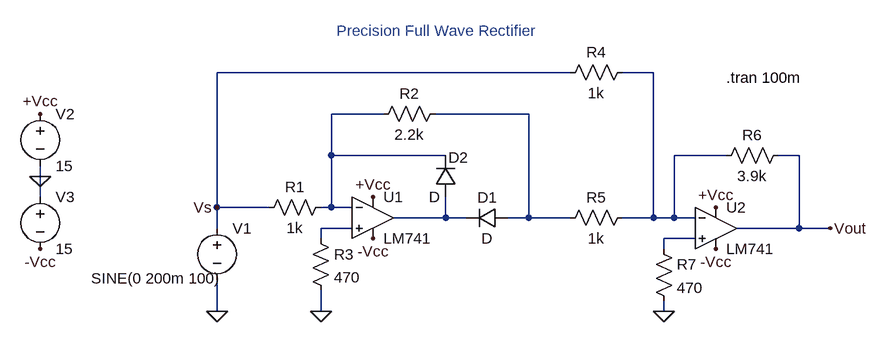
[diagram p0: schematic FWRect.asc]
FWRect.asc, the LTspice schematic file:
Version 4
SHEET 1 1192 680
WIRE 720 -96 176 -96
WIRE 848 -96 800 -96
WIRE 432 -32 352 -32
WIRE 656 -32 512 -32
WIRE 352 32 352 -32
WIRE 528 32 352 32
WIRE 960 32 880 32
WIRE 1072 32 1040 32
WIRE -96 64 -96 48
WIRE -96 96 -96 64
WIRE 176 112 176 -96
WIRE 256 112 176 112
WIRE 352 112 352 32
WIRE 352 112 336 112
WIRE 384 112 352 112
WIRE 528 128 528 96
WIRE 528 128 448 128
WIRE 560 128 528 128
WIRE 656 128 656 -32
WIRE 656 128 624 128
WIRE 720 128 656 128
WIRE 848 128 848 -96
WIRE 848 128 800 128
WIRE 880 128 880 32
WIRE 880 128 848 128
WIRE 912 128 880 128
WIRE 176 144 176 112
WIRE 384 144 336 144
WIRE 1072 144 1072 32
WIRE 1072 144 976 144
WIRE 1120 144 1072 144
WIRE 336 160 336 144
WIRE 912 160 864 160
WIRE 864 176 864 160
WIRE 176 272 176 224
WIRE 336 272 336 240
WIRE 864 272 864 256
FLAG 336 272 0
FLAG 176 272 0
FLAG -96 64 0
FLAG -96 -32 +Vcc
FLAG 416 96 +Vcc
FLAG -96 176 -Vcc
FLAG 416 160 -Vcc
FLAG 944 112 +Vcc
FLAG 944 176 -Vcc
FLAG 864 272 0
FLAG 176 112 Vs
FLAG 1120 144 Vout
SYMBOL voltage 176 128 R0
WINDOW 3 -194 93 Left 2
WINDOW 39 0 0 Left 2
SYMATTR Value SINE(0 200m 100)
SYMATTR InstName V1
SYMATTR Value2 AC 50m 0
SYMBOL Opamps\\LM741 416 64 R0
SYMATTR InstName U1
SYMBOL res 352 96 R90
WINDOW 0 0 56 VBottom 2
WINDOW 3 32 56 VTop 2
SYMATTR InstName R1
SYMATTR Value 1k
SYMBOL res 320 144 R0
SYMATTR InstName R3
SYMATTR Value 470
SYMBOL diode 544 96 R180
WINDOW 0 -19 61 Left 2
WINDOW 3 24 0 Left 2
SYMATTR InstName D2
SYMBOL diode 624 112 R90
WINDOW 0 0 32 VBottom 2
WINDOW 3 32 32 VTop 2
SYMATTR InstName D1
SYMBOL res 528 -48 R90
WINDOW 0 0 56 VBottom 2
WINDOW 3 32 56 VTop 2
SYMATTR InstName R2
SYMATTR Value 2.2k
SYMBOL res 816 -112 R90
WINDOW 0 0 56 VBottom 2
WINDOW 3 32 56 VTop 2
SYMATTR InstName R4
SYMATTR Value 1k
SYMBOL res 816 112 R90
WINDOW 0 0 56 VBottom 2
WINDOW 3 32 56 VTop 2
SYMATTR InstName R5
SYMATTR Value 1k
SYMBOL voltage -96 -48 R0
SYMATTR InstName V2
SYMATTR Value 15
SYMBOL voltage -96 80 R0
SYMATTR InstName V3
SYMATTR Value 15
SYMBOL Opamps\\LM741 944 80 R0
SYMATTR InstName U2
SYMBOL res 1056 16 R90
WINDOW 0 0 56 VBottom 2
WINDOW 3 32 56 VTop 2
SYMATTR InstName R6
SYMATTR Value 3.9k
SYMBOL res 848 160 R0
SYMATTR InstName R7
SYMATTR Value 470
TEXT 960 -88 Left 2 !.tran 100m
TEXT 360 -160 Left 2 ;Precision Full Wave Rectifier

The netlist it stands for:
* FWRect.asc
V1 Vs 0 SINE(0 200m 100) AC 50m 0
XU1 N005 N002 +Vcc -Vcc N004 LM741  ; pins In+ In- V+ V- OUT
R1 N002 Vs 1k
R3 N005 0 470
D2 N004 N002 D
D1 N003 N004 D
R2 N003 N002 2.2k
R4 N001 Vs 1k
R5 N001 N003 1k
V2 +Vcc 0 15
V3 0 -Vcc 15
XU2 N006 N001 +Vcc -Vcc Vout LM741  ; pins In+ In- V+ V- OUT
R6 Vout N001 3.9k
R7 N006 0 470
.model D D
.lib standard.dio
.tran 100m
* Precision Full Wave Rectifier
.lib LM741.lib
.backanno
.end